# EAGLE schematic fourth (EAGLE 9.6.2)
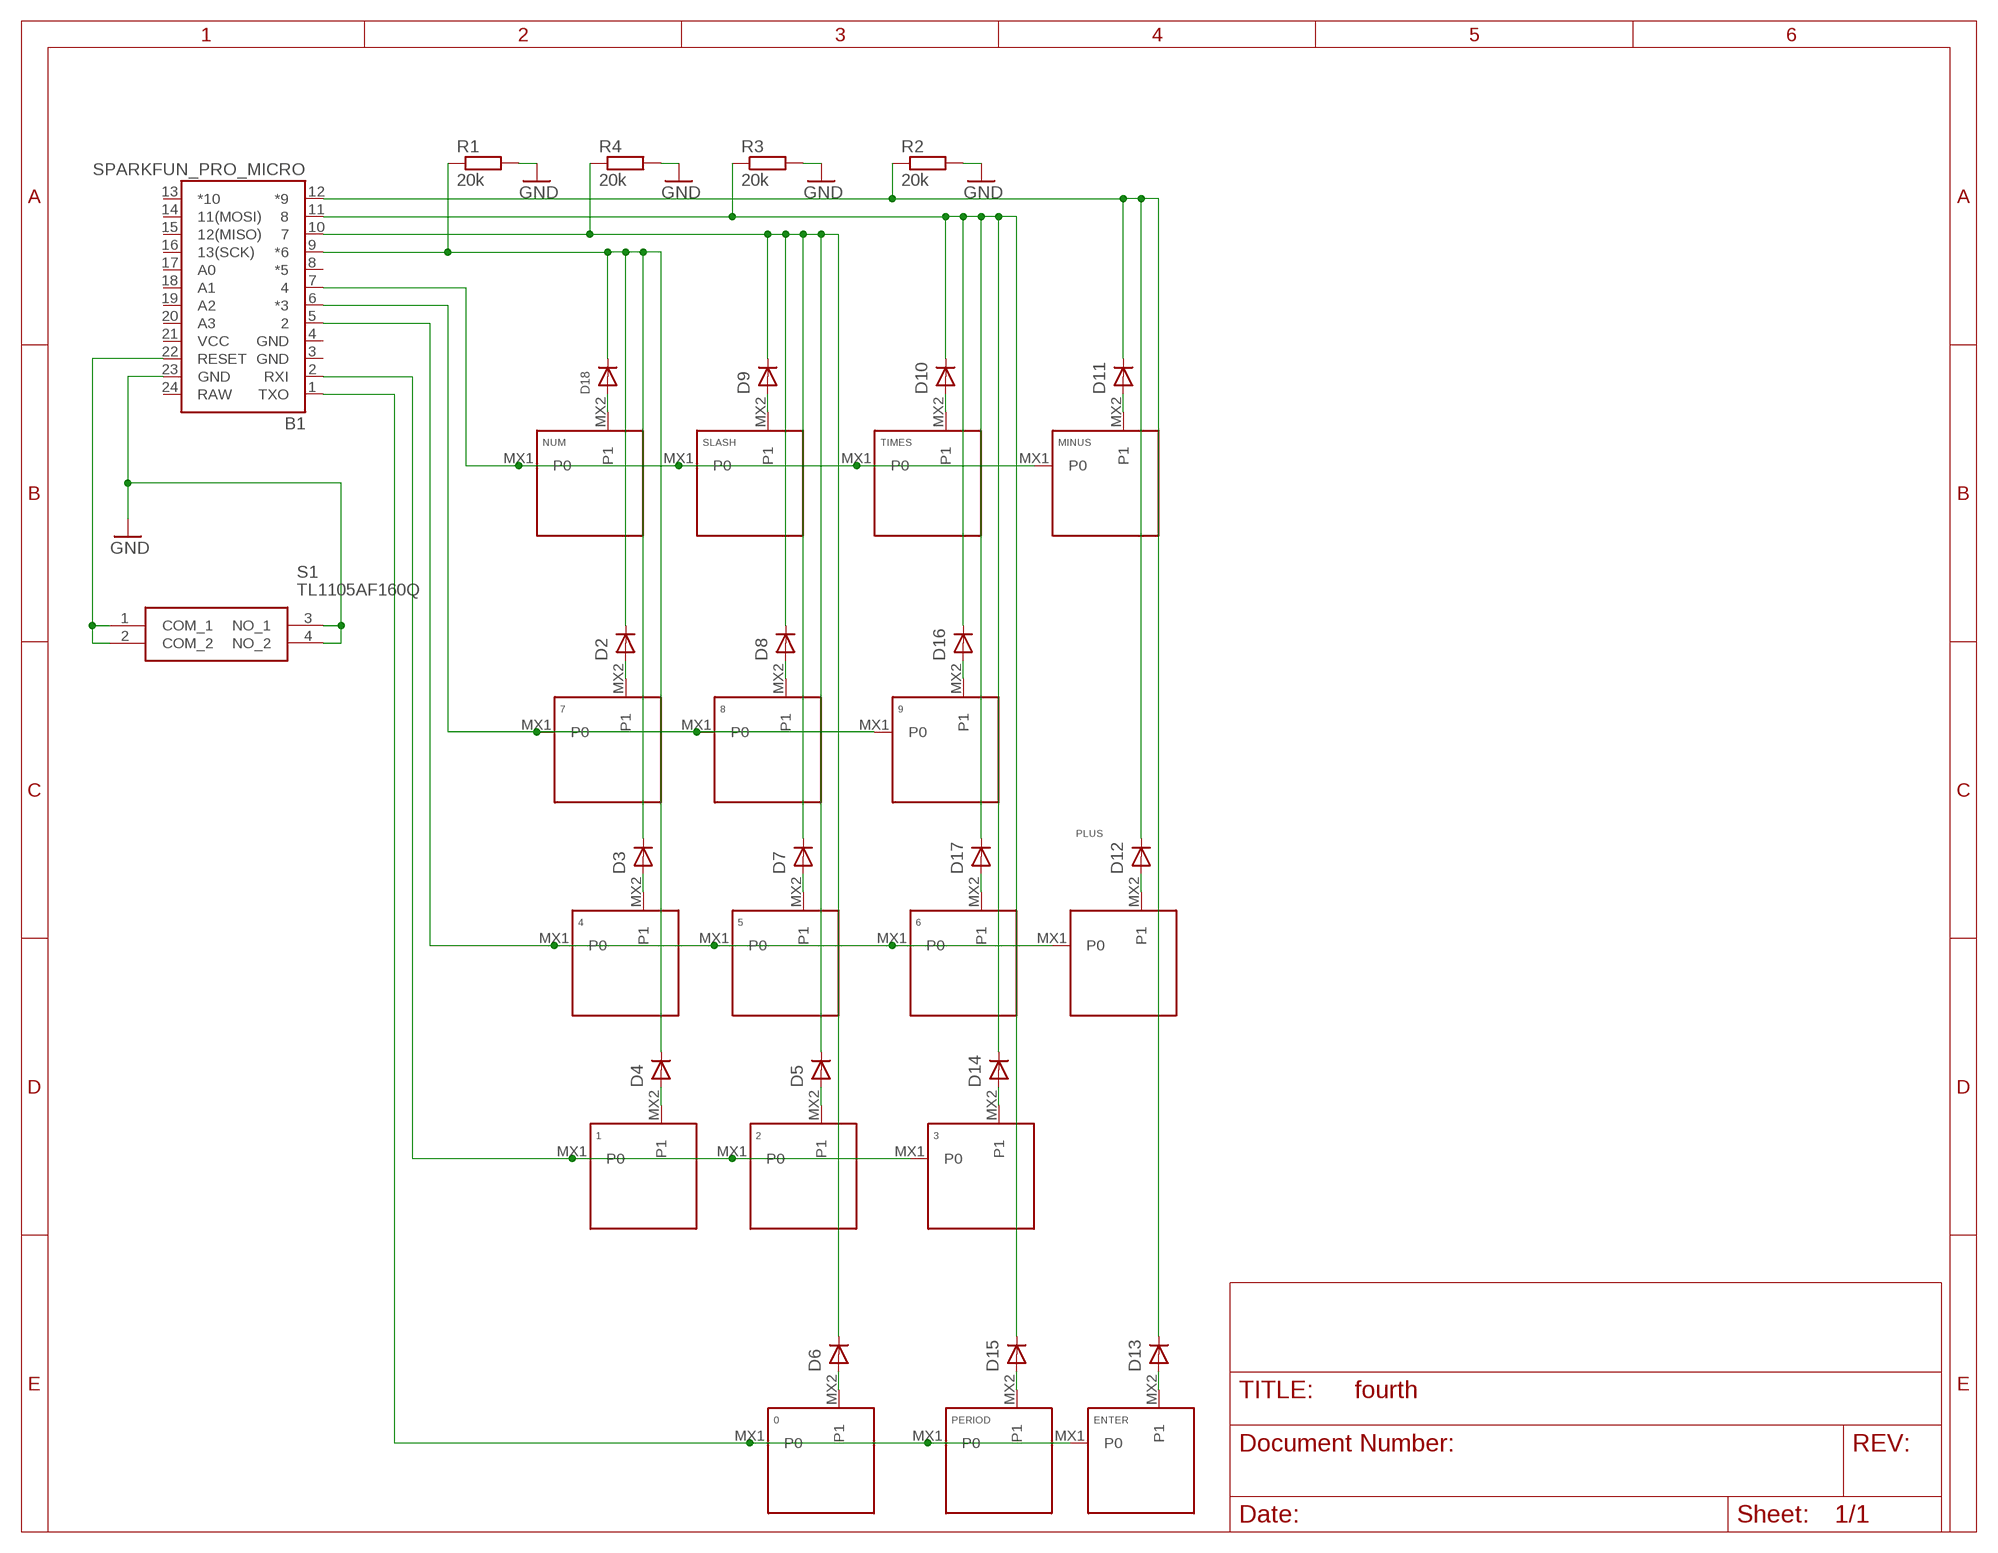
[diagram p0: schematic, sheet 1]

## Parts
0  KEYSWITCH-PLAIN-MX-2U-FLIPPED  [MX-2U-FLIPPED]
1  KEYSWITCH-PLAIN-MX-1U  [MX-1U]
2  KEYSWITCH-PLAIN-MX-1U  [MX-1U]
3  KEYSWITCH-PLAIN-MX-1U  [MX-1U]
4  KEYSWITCH-PLAIN-MX-1U  [MX-1U]
5  KEYSWITCH-PLAIN-MX-1U  [MX-1U]
6  KEYSWITCH-PLAIN-MX-1U  [MX-1U]
7  KEYSWITCH-PLAIN-MX-1U  [MX-1U]
8  KEYSWITCH-PLAIN-MX-1U  [MX-1U]
9  KEYSWITCH-PLAIN-MX-1U  [MX-1U]
B1  SPARKFUN_PRO_MICRO  [SPARKFUN_PRO_MICRO]
D2  DIODEDO-1N4148  [DO-1N4148]
D3  DIODEDO-1N4148  [DO-1N4148]
D4  DIODEDO-1N4148  [DO-1N4148]
D5  DIODEDO-1N4148  [DO-1N4148]
D6  DIODEDO-1N4148  [DO-1N4148]
D7  DIODEDO-1N4148  [DO-1N4148]
D8  DIODEDO-1N4148  [DO-1N4148]
D9  DIODEDO-1N4148  [DO-1N4148]
D10  DIODEDO-1N4148  [DO-1N4148]
D11  DIODEDO-1N4148  [DO-1N4148]
D12  DIODEDO-1N4148  [DO-1N4148]
D13  DIODEDO-1N4148  [DO-1N4148]
D14  DIODEDO-1N4148  [DO-1N4148]
D15  DIODEDO-1N4148  [DO-1N4148]
D16  DIODEDO-1N4148  [DO-1N4148]
D17  DIODEDO-1N4148  [DO-1N4148]
D18  DIODEDO-1N4148  [DO-1N4148]
ENTER  KEYSWITCH-PLAIN-MX-2U-ROTATED  [MX-2U-ROTATED]
MINUS  KEYSWITCH-PLAIN-MX-1U  [MX-1U]
NUM  KEYSWITCH-PLAIN-MX-1U  [MX-1U]
PERIOD  KEYSWITCH-PLAIN-MX-1U  [MX-1U]
PLUS  KEYSWITCH-PLAIN-MX-2U-ROTATED  [MX-2U-ROTATED]
R1  20k  RESISTOR-THT  [THT-RESISTOR]
R2  20k  RESISTOR-THT  [THT-RESISTOR]
R3  20k  RESISTOR-THT  [THT-RESISTOR]
R4  20k  RESISTOR-THT  [THT-RESISTOR]
S1  TL1105AF160Q  [TL1105AF160Q]
SLASH  KEYSWITCH-PLAIN-MX-1U  [MX-1U]
TIMES  KEYSWITCH-PLAIN-MX-1U  [MX-1U]

## Nets
GND: B1.23(GND) R1.2 R2.2 R3.2 R4.2 S1.3(NO_1) S1.4(NO_2)
N$1: 7.MX2(P1) D2.A
N$2: 4.MX2(P1) D3.A
N$3: 1.MX2(P1) D4.A
N$4: 2.MX2(P1) D5.A
N$5: 0.MX2(P1) D6.A
N$6: 5.MX2(P1) D7.A
N$7: 8.MX2(P1) D8.A
N$8: D9.A SLASH.MX2(P1)
N$9: D10.A TIMES.MX2(P1)
N$10: D11.A MINUS.MX2(P1)
N$11: D12.A PLUS.MX2(P1)
N$12: D13.A ENTER.MX2(P1)
N$13: 3.MX2(P1) D14.A
N$14: D15.A PERIOD.MX2(P1)
N$15: 9.MX2(P1) D16.A
N$16: B1.9(*6) D2.C D3.C D4.C D18.C R1.1
N$17: 6.MX2(P1) D17.A
N$18: D18.A NUM.MX2(P1)
N$19: 0.MX1(P0) B1.1(TXO) ENTER.MX1(P0) PERIOD.MX1(P0)
N$20: 1.MX1(P0) 2.MX1(P0) 3.MX1(P0) B1.2(RXI)
N$21: 4.MX1(P0) 5.MX1(P0) 6.MX1(P0) B1.5 PLUS.MX1(P0)
N$22: 7.MX1(P0) 8.MX1(P0) 9.MX1(P0) B1.6(*3)
N$23: B1.7 MINUS.MX1(P0) NUM.MX1(P0) SLASH.MX1(P0) TIMES.MX1(P0)
N$24: B1.22(RESET) S1.1(COM_1) S1.2(COM_2)
N$25: B1.10 D5.C D6.C D7.C D8.C D9.C R4.1
N$26: B1.11 D10.C D14.C D15.C D16.C D17.C R3.1
N$27: B1.12(*9) D11.C D12.C D13.C R2.1
Unconnected: B1.8(*5) B1.13(*10) B1.14(11(MOSI)) B1.15(12(MISO)) B1.16(13(SCK)) B1.17(A0) B1.18(A1) B1.19(A2) B1.20(A3)

## Power pins joined to a net without a drawn wire
GND: B1.3(GND) B1.4(GND)
RAW: B1.24(RAW)
VCC: B1.21(VCC)

## Library data of the parts
0 1-9 ENTER MINUS NUM PERIOD PLUS SLASH TIMES = Keyboard:KEYSWITCH-PLAIN
B1 = SparkFun-Boards:SPARKFUN_PRO_MICRO: SparkFun Pro Micro Atmega32U4 compatible footprint. SparkFun Products: 3.3V/8MHz <https://www.sparkfun.com/products/12587> 5V/16MHz <https://www.sparkfun.com/products/12640>
D2-D18 = adafruit:DIODE: Diode SMADIODE - SMA Surface Mount Package 20V 1A Schottky Diode Digikey: 641-1014-6-ND DO-1N4148 - Through Hole Small Current Diode SOD-123 20V 1 A (.5mV Vf) Schottky Diode - Digikey: MBRX120TPMSCT-ND SOD-323 10V 570mA (.38mV Vf, 3ns) Schottky Diode - Digikey: ZLLS410CT-ND SOD-523 30V 30mA Schottky Diode (RB751S-40TE61) - Digikey: RB751S-40TE61CT-ND SOT23-R/W - SOT23 Package (R = Solder Paste/Reflow Ovens, W = Hand-Soldering) BAT54Film 40V 300mA - Digikey: 497-7162-1-ND
R1-R4 = Components:RESISTOR
S1 = SamacSys_Parts:TL1105AF160Q: E-SWITCH - TL1105AF160Q - SWITCH, TACTILE SPST, 50mA, THROUGH HOLE Source: Datasheet <https://componentsearchengine.com/Datasheets/1/TL1105AF160Q.pdf>; DESCRIPTION: E-SWITCH - TL1105AF160Q - SWITCH, TACTILE SPST, 50mA, THROUGH HOLE; HEIGHT: 6.8mm; MANUFACTURER_NAME: E-Switch; MANUFACTURER_PART_NUMBER: TL1105AF160Q; MOUSER_PART_NUMBER: 612-TL1105A; MOUSER_PRICE-STOCK: https://www.mouser.co.uk/ProductDetail/E-Switch/TL1105AF160Q?qs=YXf4ACKMM4wdc4witUH7eQ%3D%3D